# EAGLE design ESP32 Breakout (EAGLE 9.4.2)
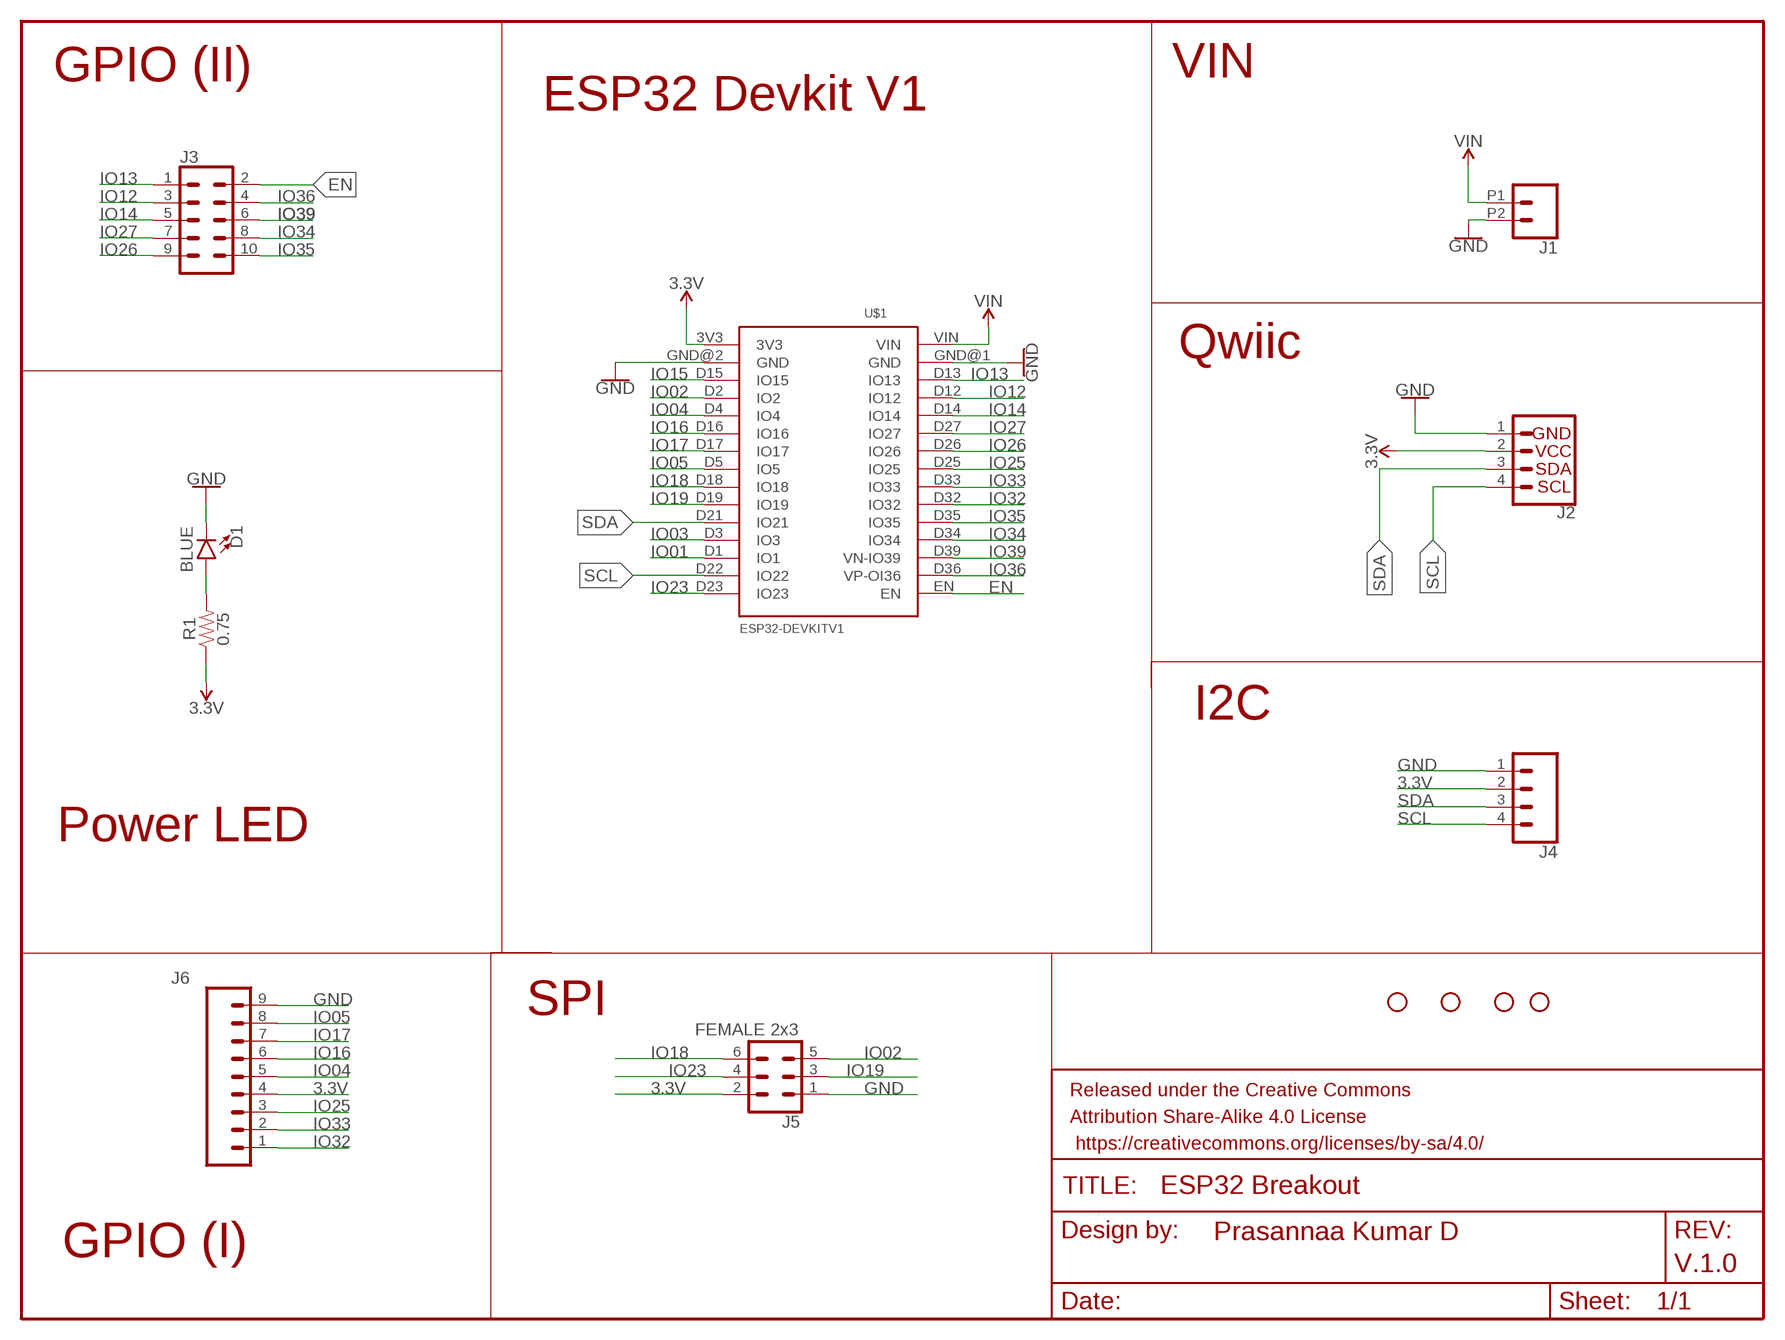
[diagram p0: schematic, sheet 1]

## Parts
D1  BLUE  LED-BLUE1206  [LED-1206]
FRAME1  FRAME-LETTER  [CREATIVE_COMMONS]
H1  STAND-OFFTIGHT  [STAND-OFF-TIGHT]
H2  STAND-OFFTIGHT  [STAND-OFF-TIGHT]
H3  STAND-OFFTIGHT  [STAND-OFF-TIGHT]
H4  STAND-OFFTIGHT  [STAND-OFF-TIGHT]
J1  CONN_022.54MM_SCREWTERM  [1X02_2.54_SCREWTERM]
J2  QWIIC_CONNECTORJS-1MM  [1X04_1MM_RA]
J3  CONN_05X2SHD  [2X5-SHROUDED]
J4  CONN_041X04_NO_SILK  [1X04_NO_SILK]
J5  FEMALE 2x3  CONN_03X2FEMALE  [2X3]
J6  CONN_09NO_SILK  [1X09_NO_SILK]
R1  0.75  0.75OHM-0805-1/4W-1%  [0805]
U$1  ESP32DEVKITV1  [ESP32-DEVKITV1]

## Nets
3.3V: J2.2(VCC) J4.2 J5.2 J6.4 R1.1 U$1.3V3
EN: J3.2 U$1.EN
GND: D1.C J1.P2 J2.1(GND) J4.1 J5.1 J6.9 U$1.GND@1(GND) U$1.GND@2(GND)
IO01: U$1.D1(IO1)
IO02: J5.5 U$1.D2(IO2)
IO03: U$1.D3(IO3)
IO04: J6.5 U$1.D4(IO4)
IO05: J6.8 U$1.D5(IO5)
IO12: J3.3 U$1.D12(IO12)
IO13: J3.1 U$1.D13(IO13)
IO14: J3.5 U$1.D14(IO14)
IO15: U$1.D15(IO15)
IO16: J6.6 U$1.D16(IO16)
IO17: J6.7 U$1.D17(IO17)
IO18: J5.6 U$1.D18(IO18)
IO19: J5.3 U$1.D19(IO19)
IO23: J5.4 U$1.D23(IO23)
IO25: J6.3 U$1.D25(IO25)
IO26: J3.9 U$1.D26(IO26)
IO27: J3.7 U$1.D27(IO27)
IO32: J6.1 U$1.D32(IO32)
IO33: J6.2 U$1.D33(IO33)
IO34: J3.8 U$1.D34(IO34)
IO35: J3.10 U$1.D35(IO35)
IO36: J3.4 U$1.D36(VP-OI36)
IO39: J3.6 U$1.D39(VN-IO39)
N$1: D1.A R1.2
SCL: J2.4(SCL) J4.4 U$1.D22(IO22)
SDA: J2.3(SDA) J4.3 U$1.D21(IO21)
VIN: J1.P1 U$1.VIN

## Notes on the sheet
- GPIO (II) | VIN
- ESP32 Devkit V1
- Qwiic
- I2C
- Power LED
- SPI
- GPIO (I)

## Library data of the parts
D1 = SparkFun-LED:LED-BLUE: Blue SMD LED Used in manufacturing of various products at SparkFun Packages: 0603 - SMD 0603 package [Product Link] <http://www.digikey.com/product-detail/en/SMLE12BC7TT86/511-1589-2-ND/1641808> 1206 - SMD1206 package [Product Link] <http://www.digikey.com/product-detail/en/lite-on-inc/LTST-C150TBKT/160-1643-1-ND/573584> SparkFun Products: ESP8266 Thing-Dev Board <https://www.sparkfun.com/products/13711> RedBoard <https://www.sparkfun.com/products/12757>; PROD_ID: DIO-09911
FRAME1 = SparkFun-Aesthetics:FRAME-LETTER: Schematic Frame - Letter Standard 8.5x11 US Letter frame; DESIGNER: Prasannaa Kumar D; REV: V.1.0
H1-H4 = SparkFun-Hardware:STAND-OFF: Stand Off Drill holes for mechanically mounting via screws, standoffs, etc. Note: Use the keepout ring to avoid running the screw head into surrounding components. Variant Overviews STAND-OFF - Mechanical footprint for a #4 phillips button head screw. STAND-OFF-TIGHT - Mechanical footprint for a #4 phillips button head screw, Example SparkFun Products Screw - Phillips Head (1/4", 4-40, 10 pack) <https://www.sparkfun.com/products/10453> (PRT-10453) Screw - Phillips Head (1/2", 4-40, 10 pack) <https://www.sparkfun.com/products/10452> (PRT-10452) Screw - Phillips Head (3/4", 4-40, 10 pack) <https://www.sparkfun.com/products/10451> (PRT-10451) Screw - Phillips Head (1", 4-40, 10 pack) <https://www.sparkfun.com/products/10450> (PRT-10450)
J1 = SparkFun-Connectors:CONN_02: Multi connection point. Often used as Generic Header-pin footprint for 0.1 inch spaced/style header connections On any of the 0.1 inch spaced packages, you can populate with these: Break Away Headers - Straight <https://www.sparkfun.com/products/116> (PRT-00116) Break Away Male Headers - Right Angle <https://www.sparkfun.com/products/553> (PRT-00553) Female Headers <https://www.sparkfun.com/products/115> (PRT-00115) Break Away Headers - Machine Pin <https://www.sparkfun.com/products/117> (PRT-00117) Break Away Female Headers - Swiss Machine Pin <https://www.sparkfun.com/products/743> (PRT-00743) For SCREWTERMINALS and SPRING TERMINALS visit here: Screw Terimnals on SparkFun.com <https://www.sparkfun.com/search/results?term=Screw+Terminals> (5mm/3.5mm/2.54mm spacing) This device is also useful as a general connection point to wire up your design to another part of your project. Our various solder wires solder well into these plated through hole pads. Hook-Up Wire - Assortment (Stranded, 22 AWG) <https://www.sparkfun.com/products/11375> (PRT-11375) Hook-Up Wire - Assortment (Solid Core, 22 AWG) <https://www.sparkfun.com/products/11367> (PRT-11367) View the entire wire category on our website here <https://www.sparkfun.com/categories/141> Special notes: Molex polarized connector foot print use with: PRT-08233 with associated crimp pins and housings. 2.54_SCREWTERM for use with PRT-10571. 3.5mm Screw Terminal footprints for PRT-08084 5mm Screw Terminal footprints for use with PRT-08432
J2 = SparkFun-Connectors:QWIIC_CONNECTOR: SparkFun I2C Standard Qwiic Connector An SMD 1mm pitch JST connector makes it easy and quick (get it? Qwiic?) to connect I2C devices to each other. The Qwiic system <http://www.sparkfun.com/qwiic> enables fast and solderless connection between popular platforms and various sensors and actuators. We carry 200mm <https://www.sparkfun.com/products/14204>, 100mm <https://www.sparkfun.com/products/14205>, 50mm <https://www.sparkfun.com/products/14206>, and breadboard friendly <https://www.sparkfun.com/products/14207> Qwiic cables. We also offer 10 pcs strips <https://www.sparkfun.com/products/14323> the SMD connectors.
J3 = SparkFun-Connectors:CONN_05X2: Multi connection point. Often used as Generic Header-pin footprint for 0.1 inch spaced/style header connections For AVR SPI programming port, see special device with nice symbol: "AVR_SPI_PROG_5x2.dev" You can populate with any combo of single row headers, but if you'd like an exact match, check these: 2x5 AVR ICSP Male Header <https://www.sparkfun.com/products/778> (PRT-00778) 2x5 Pin Shrouded Header <https://www.sparkfun.com/products/8506> (PRT-08506) On any of the 0.1 inch spaced packages, you can populate with these: Break Away Headers - Straight <https://www.sparkfun.com/products/116> (PRT-00116) Break Away Male Headers - Right Angle <https://www.sparkfun.com/products/553> (PRT-00553) Female Headers <https://www.sparkfun.com/products/115> (PRT-00115) Break Away Headers - Machine Pin <https://www.sparkfun.com/products/117> (PRT-00117) Break Away Female Headers - Swiss Machine Pin <https://www.sparkfun.com/products/743> (PRT-00743) Special note: the shrouded connector mates well with our 5x2 ribbon cables: 2x5 Pin IDC Ribbon Cable <https://www.sparkfun.com/products/8535> (PRT-08535); PROD_ID: CONN-08671; SF_ID: PRT-08506
J4 = SparkFun-Connectors:CONN_04: Multi connection point. Often used as Generic Header-pin footprint for 0.1 inch spaced/style header connections On any of the 0.1 inch spaced packages, you can populate with these: Break Away Headers - Straight <https://www.sparkfun.com/products/116> (PRT-00116) Break Away Male Headers - Right Angle <https://www.sparkfun.com/products/553> (PRT-00553) Female Headers <https://www.sparkfun.com/products/115> (PRT-00115) Break Away Headers - Machine Pin <https://www.sparkfun.com/products/117> (PRT-00117) Break Away Female Headers - Swiss Machine Pin <https://www.sparkfun.com/products/743> (PRT-00743) For SCREWTERMINALS and SPRING TERMINALS visit here: Screw Terimnals on SparkFun.com <https://www.sparkfun.com/search/results?term=Screw+Terminals> (5mm/3.5mm/2.54mm spacing) This device is also useful as a general connection point to wire up your design to another part of your project. Our various solder wires solder well into these plated through hole pads. Hook-Up Wire - Assortment (Stranded, 22 AWG) <https://www.sparkfun.com/products/11375> (PRT-11375) Hook-Up Wire - Assortment (Solid Core, 22 AWG) <https://www.sparkfun.com/products/11367> (PRT-11367) View the entire wire category on our website here <https://www.sparkfun.com/categories/141> Special notes: Molex polarized connector foot print use with SKU : PRT-08231 with associated crimp pins and housings. 1MM SMD Version SKU: PRT-10208; PROD_ID: CONN-09696
J5 = SparkFun-Connectors:CONN_03X2: Multi connection point. Often used as Generic Header-pin footprint for 0.1 inch spaced/style header connections You can populate with any combo of single row headers, but if you'd like an exact match, check these: Header - 2x3 (Male, 0.1") <https://www.sparkfun.com/products/12807> (PRT-12807) Header - 2x3 (Female, 0.1") <https://www.sparkfun.com/products/13010> (PRT-13010) 2x3 Pin Shrouded Header <https://www.sparkfun.com/products/10877> (PRT-10877) On any of the 0.1 inch spaced packages, you can populate with these: Break Away Headers - Straight <https://www.sparkfun.com/products/116> (PRT-00116) Break Away Male Headers - Right Angle <https://www.sparkfun.com/products/553> (PRT-00553) Female Headers <https://www.sparkfun.com/products/115> (PRT-00115) Break Away Headers - Machine Pin <https://www.sparkfun.com/products/117> (PRT-00117) Break Away Female Headers - Swiss Machine Pin <https://www.sparkfun.com/products/743> (PRT-00743) Special note: the shrouded connector mates well with our 3x2 ribbon cables: Ribbon Crimp Connector - 6-pin (2x3, Female) <https://www.sparkfun.com/products/10651> (PRT-10651) Ribbon Cable - 6 wire (15ft) <https://www.sparkfun.com/products/10646> (PRT-10646); PROD_ID: CONN-11566
J6 = SparkFun-Connectors:CONN_09: Multi connection point. Often used as Generic Header-pin footprint for 0.1 inch spaced/style header connections On any of the 0.1 inch spaced packages, you can populate with these: Break Away Headers - Straight <https://www.sparkfun.com/products/116> (PRT-00116) Break Away Male Headers - Right Angle <https://www.sparkfun.com/products/553> (PRT-00553) Female Headers <https://www.sparkfun.com/products/115> (PRT-00115) Break Away Headers - Machine Pin <https://www.sparkfun.com/products/117> (PRT-00117) Break Away Female Headers - Swiss Machine Pin <https://www.sparkfun.com/products/743> (PRT-00743) For SCREWTERMINALS and SPRING TERMINALS visit here: Screw Terimnals on SparkFun.com <https://www.sparkfun.com/search/results?term=Screw+Terminals> (5mm/3.5mm/2.54mm spacing) This device is also useful as a general connection point to wire up your design to another part of your project. Our various solder wires solder well into these plated through hole pads. Hook-Up Wire - Assortment (Stranded, 22 AWG) <https://www.sparkfun.com/products/11375> (PRT-11375) Hook-Up Wire - Assortment (Solid Core, 22 AWG) <https://www.sparkfun.com/products/11367> (PRT-11367) View the entire wire category on our website here <https://www.sparkfun.com/categories/141> Special notes: Molex polarized connector foot print use with SKU : PRT-08231 with associated crimp pins and housings. 1MM SMD Version SKU: PRT-10208 NOTES ON THE VARIANTS LOCK and LOCK_LONGPADS... This footprint was designed to help hold the alignment of a through-hole component (i.e. 6-pin header) while soldering it into place. You may notice that each hole has been shifted either up or down by 0.005 of an inch from it's more standard position (which is a perfectly straight line). This slight alteration caused the pins (the squares in the middle) to touch the edges of the holes. Because they are alternating, it causes a "brace" to hold the component in place. 0.005 has proven to be the perfect amount of "off-center" position when using our standard breakaway headers. Although looks a little odd when you look at the bare footprint, once you have a header in there, the alteration is very hard to notice. Also,if you push a header all the way into place, it is covered up entirely on the bottom side.
R1 = SparkFun-Resistors:0.75OHM: 0.75Ω resistor A resistor is a passive two-terminal electrical component that implements electrical resistance as a circuit element. Resistors act to reduce current flow, and, at the same time, act to lower voltage levels within circuits. - Wikipedia; PROD_ID: RES-08474
U$1 = ESP32-DEVKITV1:ESP32DEVKITV1

## Board
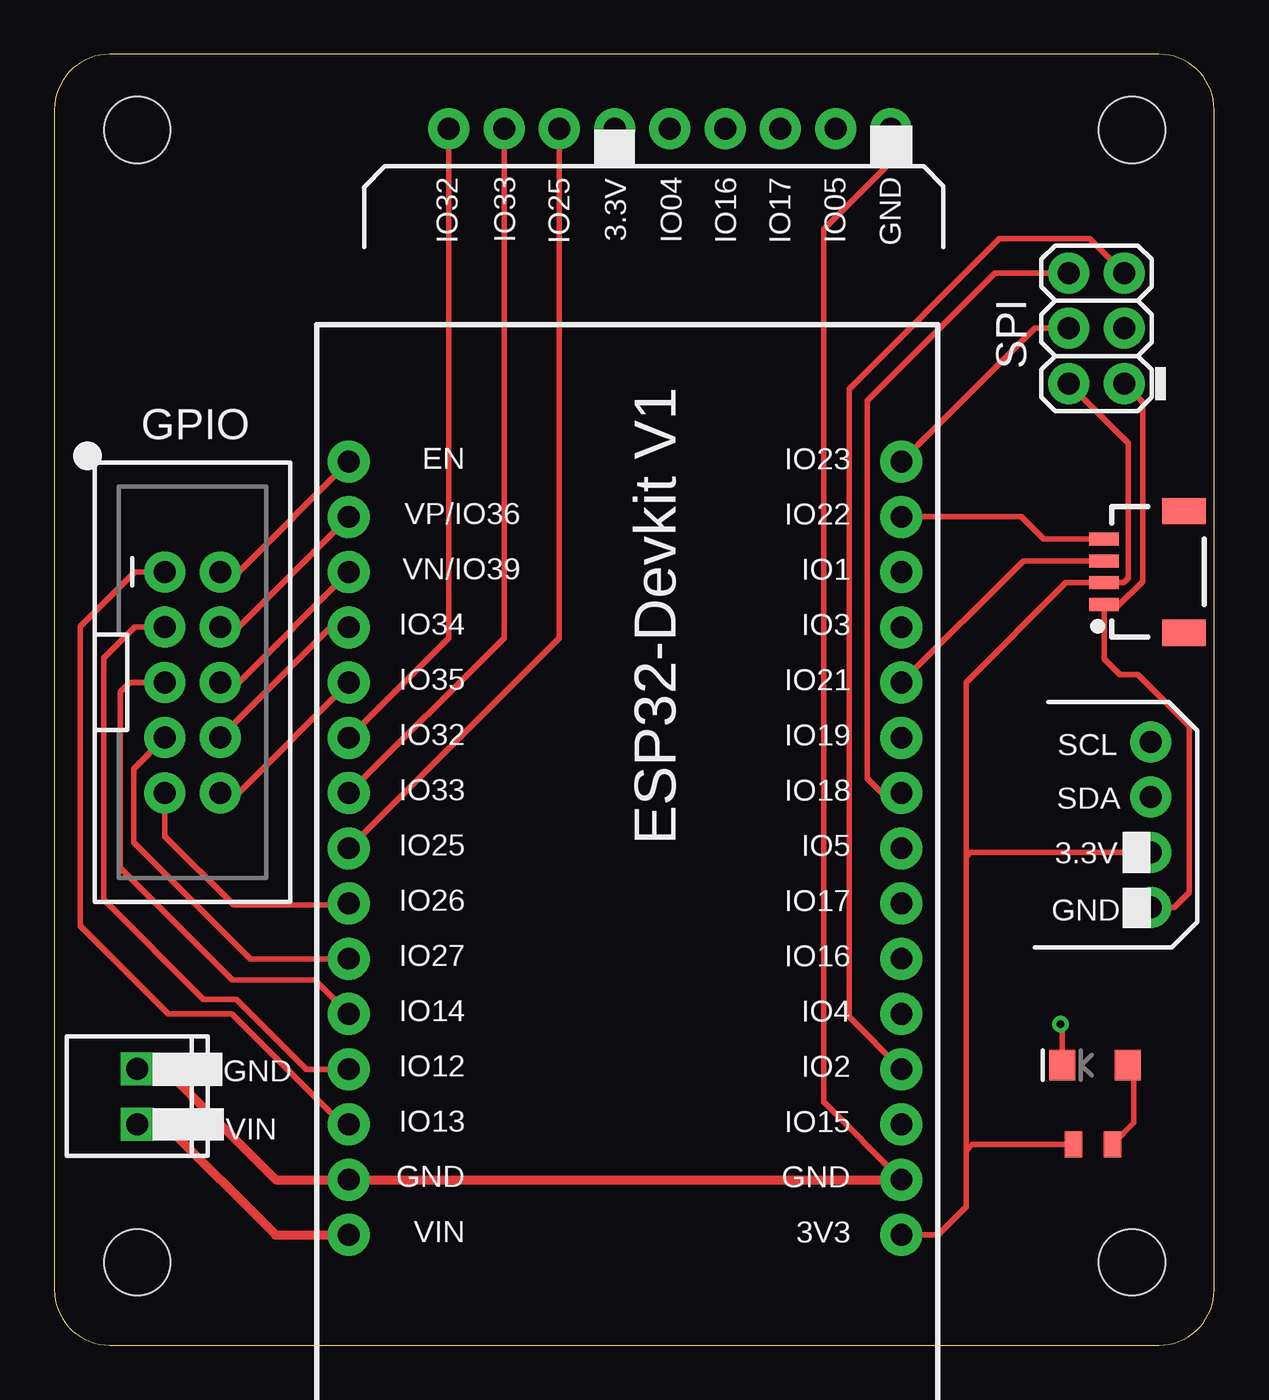
[diagram p1: board, top side]
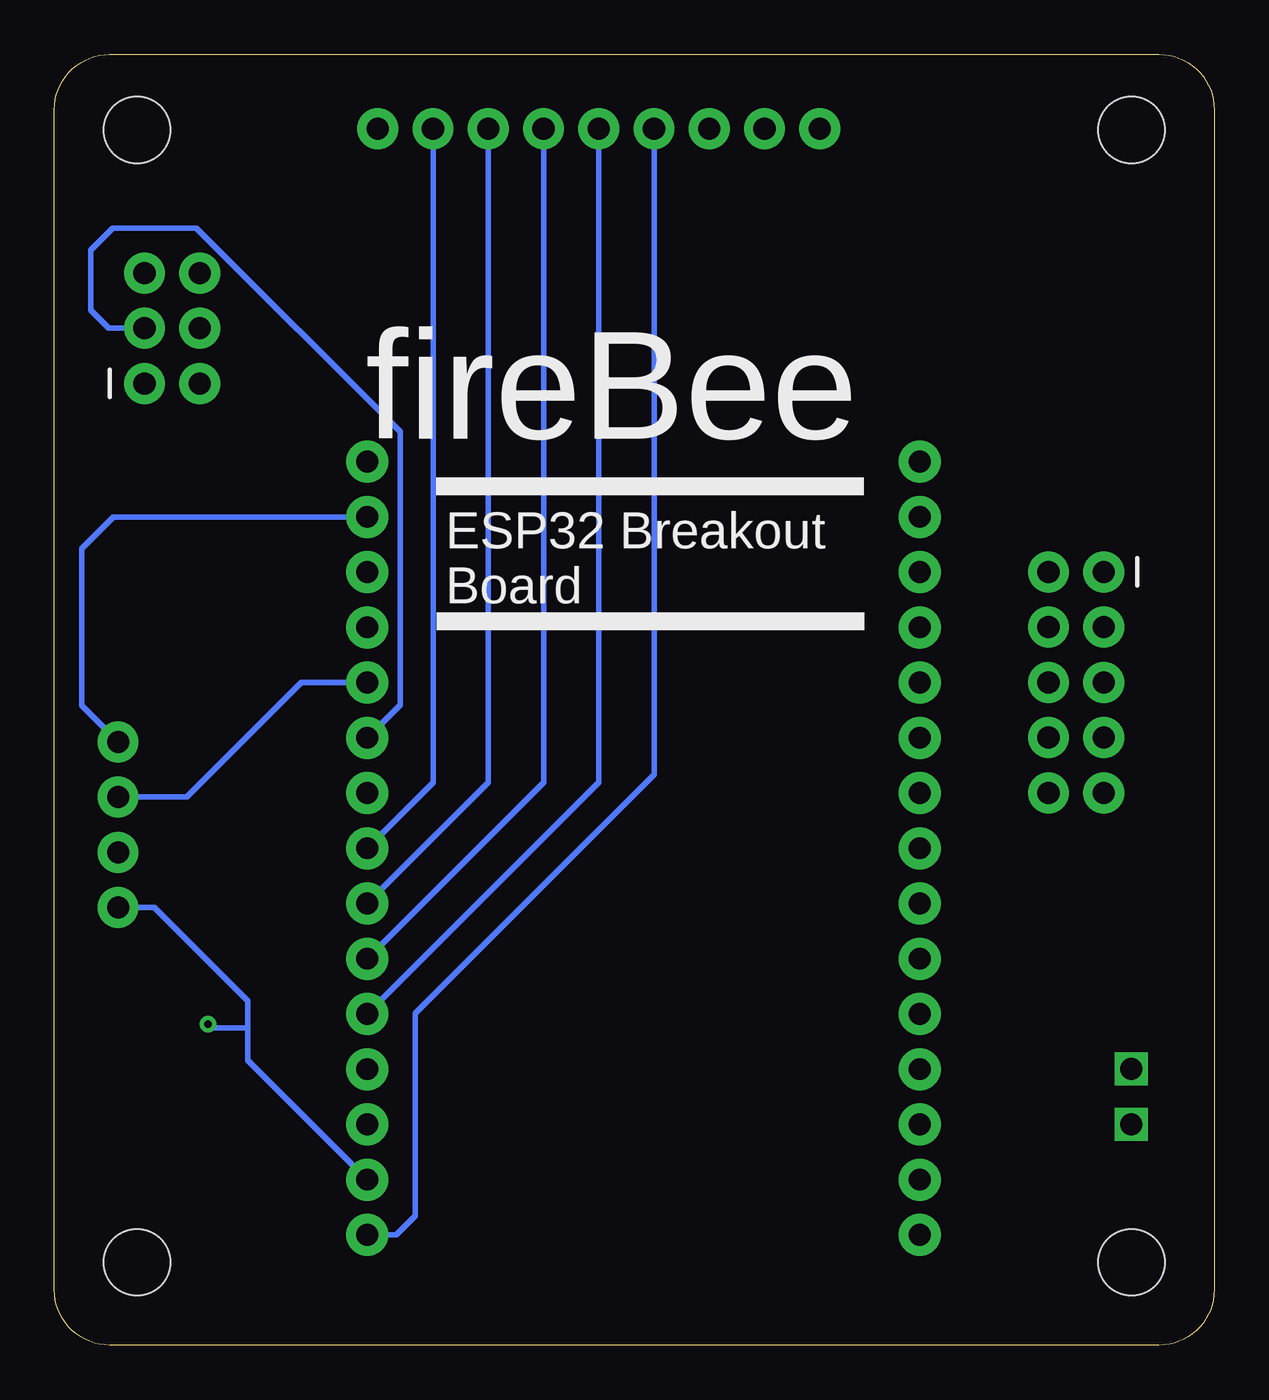
[diagram p2: board, bottom side, seen from below]

Size 53.32 x 59.36 mm. Coordinates in mm from the lower left corner, seen from the top.
Outline: 50.78,59.36 2.54,59.36 arc90 0,56.82 0,2.54 arc90 2.54,0 50.78,0 arc90 53.32,2.54 53.32,56.82 arc90 50.78,59.36
Copper layers (1*16): Top 0.035mm / dielectric 1.5mm / Bottom 0.035mm
Design rules "default": minimum track width 6mil, minimum drill 0.35mm, track to track 6mil, track to pad 6mil, pad to pad 6mil, via to via 6mil, smd to smd 6mil, copper to edge 40mil, drill to drill 6mil, minimum pad ring 10mil, minimum via ring 8mil, stop-mask expansion 4mil, vias tented up to drill 0mil, thermal gap 10mil

### Footprints (pad centres in the part's own frame; a part is rotated, then mirrored left to right if it is on the bottom)
LED-1206 = smd 1.2 x 1.4: A -1.5,0; C 1.5,0
STAND-OFF-TIGHT = hole 3.048: 0,0
1X02_2.54_SCREWTERM = drill 1.016 square: P1 2.54,0; P2 0,0
1X04_1MM_RA = smd 0.6 x 1.35: 1 -1.5,0; 2 -0.5,0; 3 0.5,0; 4 1.5,0 | smd 1.2 x 2: NC1 2.8,-3.675; NC2 -2.8,-3.675
2X5-SHROUDED = drill 1.016 pad 1.88: 1 -1.27,5.08; 2 1.27,5.08; 3 -1.27,2.54; 4 1.27,2.54; 5 -1.27,0; 6 1.27,0; 7 -1.27,-2.54; 8 1.27,-2.54; 9 -1.27,-5.08; 10 1.27,-5.08
1X04_NO_SILK = drill 1.016 pad 1.88: 1 0,0; 2 2.54,0; 3 5.08,0; 4 7.62,0
2X3 = drill 1.016 pad 1.88: 1 0,0; 2 0,2.54; 3 2.54,0; 4 2.54,2.54; 5 5.08,0; 6 5.08,2.54
1X09_NO_SILK = drill 1.016 pad 1.88: 1 0,0; 2 2.54,0; 3 5.08,0; 4 7.62,0; 5 10.16,0; 6 12.7,0; 7 15.24,0; 8 17.78,0; 9 20.32,0
0805 = smd 0.8 x 1.2: 1 -0.9,0; 2 0.9,0
ESP32-DEVKITV1 = drill 1 pad 1.93: 3V3 -16.52,-12.27; D1 13.96,-12.27; D2 -8.9,-12.27; D3 11.42,-12.27; D4 -6.36,-12.27; D5 1.26,-12.27; D12 -8.9,13.135; D13 -11.44,13.135; D14 -6.36,13.135; D15 -11.44,-12.27; D16 -3.82,-12.27; D17 -1.28,-12.27; D18 3.8,-12.27; D19 6.34,-12.27; D21 8.88,-12.27; D22 16.5,-12.27; D23 19.04,-12.27; D25 1.26,13.135; D26 -1.28,13.135; D27 -3.82,13.135; D32 6.34,13.135; D33 3.8,13.135; D34 11.42,13.135; D35 8.88,13.135; D36 16.5,13.135; D39 13.96,13.135; EN 19.04,13.135; GND@1 -13.98,13.135; GND@2 -13.98,-12.27; VIN -16.52,13.135

### Placement (x,y rotation side)
D1  47.84,12.87 180 top
FRAME1  10.62,-44.8 0 top  (outside the outline)
H1  3.81,3.81 0 top
H2  49.53,3.81 0 top
H3  49.53,55.88 0 top
H4  3.81,55.88 0 top
J1  3.81,12.7 270 top
J2  48.26,35.56 90 top
J3  6.35,30.48 0 top
J4  50.39,20.13 90 top
J5  49.18,44.22 90 top
J6  18.13,55.93 0 top
R1  47.74,9.23 0 top
U$1  26.67,21.59 90 top

### Tracks (layer width: path | path; a pad name or v marks a point on that pad's centre or on a via)
3.3V
  Top 0.254: 41.91,22.47 41.91,30.48 46.49,35.06 J2.2 49.17,35.06 49.38,35.27 49.38,41.48 J5.2 | 41.91,22.47 41.91,8.94 | 41.91,8.94 41.91,6.35 40.63,5.07 U$1.3V3 | R1.1 42.2,9.23 41.91,8.94 | J4.2 42.1,22.67 41.91,22.47
  Bottom 0.254: J6.4 25.75,26.24 36.74,15.26 36.74,5.95 37.61,5.07 U$1.3V3
EN
  Top 0.254: U$1.EN 8.46,35.56 J3.2
GND  (via drill 0.35)
  Top 0.254: D1.C 46.34,14.68 v46.26,14.76 | J4.1 51.47,20.13 52.18,20.83 52.18,28.47 49.81,30.83 48.97,30.83 48.26,31.55 48.26,33.93 | 48.26,33.93 J2.1 | J5.1 50.03,43.37 50.03,35.12 48.84,33.93 48.26,33.93 | U$1.GND@2 35.36,11.19 35.36,51.31 38.45,54.4 J6.9
  Top 0.406: J1.P2 5.08,12.7 10.17,7.61 U$1.GND@1 U$1.GND@2
  Bottom 0.254: U$1.GND@2 44.42,13.09 44.42,14.59 | 44.42,14.59 44.42,15.83 48.72,20.13 J4.1 | v46.26,14.76 46.09,14.59 44.42,14.59
IO02
  Top 0.254: J5.5 47.6,50.88 43.45,50.88 36.54,43.97 36.54,15.09 U$1.D2
IO04
  Bottom 0.254: J6.5 28.29,25.88 U$1.D4
IO05
  Bottom 0.254: U$1.D5 35.91,25.88 J6.8
IO12
  Top 0.254: U$1.D12 11.57,12.69 8.36,15.9 6.85,15.9 2.26,20.5 2.26,31.59 3.69,33.02 J3.3
IO13
  Top 0.254: J3.1 3.71,35.56 1.2,33.05 1.2,19.28 5.24,15.24 8.15,15.24 13.24,10.15 U$1.D13
IO14
  Top 0.254: J3.5 3.46,30.48 3.02,30.04 3.02,21.95 8.18,16.79 11.97,16.79 U$1.D14
IO16
  Bottom 0.254: U$1.D16 30.83,25.88 J6.6
IO17
  Bottom 0.254: J6.7 33.37,25.88 U$1.D17
IO18
  Top 0.254: J5.6 43.24,49.3 37.37,43.44 37.37,26.05 38.03,25.39 U$1.D18
IO19
  Bottom 0.254: J5.3 50.82,46.76 51.65,47.59 51.65,50.36 50.64,51.37 46.79,51.37 37.42,42 37.42,29.45 U$1.D19
IO23
  Top 0.254: U$1.D23 45.07,46.76 J5.4
IO25
  Top 0.254: U$1.D25 23.21,32.53 J6.3
IO26
  Top 0.254: U$1.D26 13.46,20.23 8.24,20.23 5.08,23.39 J3.9
IO27
  Top 0.254: J3.7 3.64,26.5 3.64,23.12 8.99,17.77 U$1.D27
IO32
  Top 0.254: U$1.D32 18.13,32.53 J6.1
IO33
  Top 0.254: U$1.D33 20.67,32.53 J6.2
IO34
  Top 0.254: J3.8 12.69,33.01 U$1.D34
IO35
  Top 0.254: U$1.D35 8.46,25.4 J3.10
IO36
  Top 0.254: U$1.D36 8.46,33.02 J3.4
IO39
  Top 0.254: U$1.D39 8.46,30.48 J3.6
N$1
  Top 0.254: R1.2 49.63,10.21 49.63,12.58 D1.A
SCL
  Top 0.254: J2.4 45.49,37.06 44.45,38.1 U$1.D22
  Bottom 0.254: U$1.D22 50.6,38.09 52.07,36.63 52.07,29.42 J4.4
SDA
  Top 0.254: U$1.D21 44.53,36.06 J2.3
  Bottom 0.254: U$1.D21 41.97,30.47 47.23,25.21 J4.3
VIN
  Top 0.406: J1.P1 5.08,10.16 10.17,5.07 U$1.VIN

### Text on the board
tPlace: IO32 | IO33 | IO25 | 3.3V | IO04 | IO16 | IO17 | IO05 | GND | SPI | GPIO | SCL | SDA | 3.3V | GND | GND | VIN
bNames: fireBee | ESP32 Breakout / Board